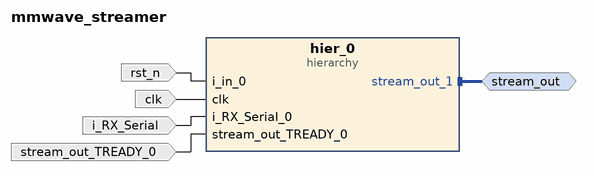
[diagram p0: block diagram of the top level]
# Vivado block design mmwave_streamer, xczu3eg-sbva484-1-i, Vivado 2020.2
create_bd_design mmwave_streamer

create_bd_intf_port -mode Master -vlnv xilinx.com:interface:axis_rtl:1.0 stream_out
create_bd_port -dir I rst_n
create_bd_port -dir I i_RX_Serial
create_bd_port -dir I -type clk clk
create_bd_port -dir I stream_out_TREADY_0

create_bd_cell -type hier hier_0

# ---- hierarchy /hier_0 ----
current_bd_instance /hier_0
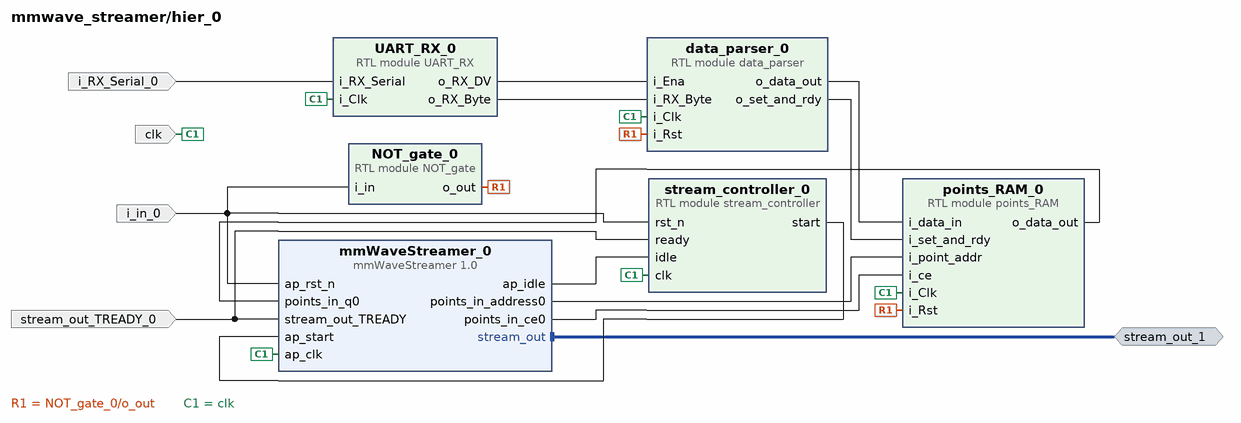
[diagram p1: block diagram inside /hier_0]
create_bd_intf_pin -mode Master -vlnv xilinx.com:interface:axis_rtl:1.0 stream_out_1
create_bd_pin -dir I i_in_0
create_bd_pin -dir I -type clk clk
create_bd_pin -dir I i_RX_Serial_0
create_bd_pin -dir I stream_out_TREADY_0

create_bd_cell -type module -reference NOT_gate NOT_gate_0
create_bd_cell -type module -reference points_RAM points_RAM_0
create_bd_cell -type ip -vlnv xilinx.com:hls:mmWaveStreamer:1.0 mmWaveStreamer_0
create_bd_cell -type module -reference UART_RX UART_RX_0
create_bd_cell -type module -reference data_parser data_parser_0
create_bd_cell -type module -reference stream_controller stream_controller_0

# ---- connections ----

current_bd_instance /hier_0
connect_bd_intf_net [get_bd_intf_pins stream_out_1] [get_bd_intf_pins mmWaveStreamer_0/stream_out]
connect_bd_net [get_bd_pins NOT_gate_0/o_out] [get_bd_pins points_RAM_0/i_Rst] [get_bd_pins data_parser_0/i_Rst]
connect_bd_net [get_bd_pins data_parser_0/o_data_out] [get_bd_pins points_RAM_0/i_data_in]
connect_bd_net [get_bd_pins mmWaveStreamer_0/points_in_address0] [get_bd_pins points_RAM_0/i_point_addr]
connect_bd_net [get_bd_pins data_parser_0/o_set_and_rdy] [get_bd_pins points_RAM_0/i_set_and_rdy]
connect_bd_net [get_bd_pins mmWaveStreamer_0/points_in_ce0] [get_bd_pins points_RAM_0/i_ce]
connect_bd_net [get_bd_pins points_RAM_0/o_data_out] [get_bd_pins mmWaveStreamer_0/points_in_q0]
connect_bd_net [get_bd_pins stream_controller_0/start] [get_bd_pins mmWaveStreamer_0/ap_start]
connect_bd_net [get_bd_pins UART_RX_0/o_RX_DV] [get_bd_pins data_parser_0/i_Ena]
connect_bd_net [get_bd_pins UART_RX_0/o_RX_Byte] [get_bd_pins data_parser_0/i_RX_Byte]
connect_bd_net -net i_in_0_1 [get_bd_pins i_in_0] \
  [get_bd_pins stream_controller_0/rst_n] [get_bd_pins mmWaveStreamer_0/ap_rst_n] [get_bd_pins NOT_gate_0/i_in]
connect_bd_net -net clk_0_1 [get_bd_pins clk] \
  [get_bd_pins stream_controller_0/clk] [get_bd_pins UART_RX_0/i_Clk] [get_bd_pins data_parser_0/i_Clk] \
  [get_bd_pins mmWaveStreamer_0/ap_clk] [get_bd_pins points_RAM_0/i_Clk]
connect_bd_net -net i_RX_Serial_0_1 [get_bd_pins i_RX_Serial_0] [get_bd_pins UART_RX_0/i_RX_Serial]
connect_bd_net [get_bd_pins mmWaveStreamer_0/ap_idle] [get_bd_pins stream_controller_0/idle]
connect_bd_net -net stream_out_TREADY_0_1 [get_bd_pins stream_out_TREADY_0] \
  [get_bd_pins mmWaveStreamer_0/stream_out_TREADY] [get_bd_pins stream_controller_0/ready]

current_bd_instance /
connect_bd_intf_net [get_bd_intf_ports stream_out] [get_bd_intf_pins hier_0/stream_out_1]
connect_bd_net -net i_in_0_1 [get_bd_ports rst_n] [get_bd_pins hier_0/i_in_0]
connect_bd_net -net clk_0_1 [get_bd_ports clk] [get_bd_pins hier_0/clk]
connect_bd_net -net i_RX_Serial_0_1 [get_bd_ports i_RX_Serial] [get_bd_pins hier_0/i_RX_Serial_0]
connect_bd_net -net stream_out_TREADY_0_1 [get_bd_ports stream_out_TREADY_0] [get_bd_pins hier_0/stream_out_TREADY_0]

validate_bd_design
save_bd_design
